# Altium project JTAG20_TO_JTAG10.PrjPcb
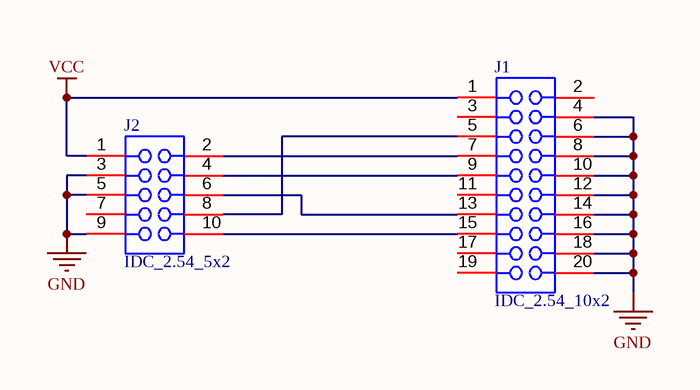
[diagram p0: JTAG20_TO_JTAG10.SchDoc]
1 sheet, 2 parts. Net scope: global (net labels, ports and power ports of the same name join across sheets).
Board file: JTAG20_TO_JTAG10.PcbDoc

## Sheet JTAG20_TO_JTAG10.SchDoc
size A4; SheetNumber: 1; SheetTotal: 1

### Parts
J1  IDC_2.54_10x2  [IDC_CONNECTOR_20_2.54]
J2  IDC_2.54_5x2  [IDC_CONNECTOR_10x2.54]

### Nets
GND: J1.4 J1.6 J1.8 J1.10 J1.12 J1.14 J1.16 J1.18 J1.20 J2.3 J2.5 J2.9
VCC: J1.1 J2.1
NetJ1_5: J1.5 J2.8
NetJ1_7: J1.7 J2.2
NetJ1_9: J1.9 J2.4
NetJ1_13: J1.13 J2.6
NetJ1_15: J1.15 J2.10

Not connected (* = marked no-connect by the designer): J1 2 3 11 17 19; J2 7